# EAGLE schematic HC05-mdl V04 (EAGLE 7.4.0)
3v3 to TTL interfaceboard for HC-04/05/06 bluetoothmodule Dipswitch is provided for manual setting AT-mode to programming module Powersupply led and State led are added for easy monitoring
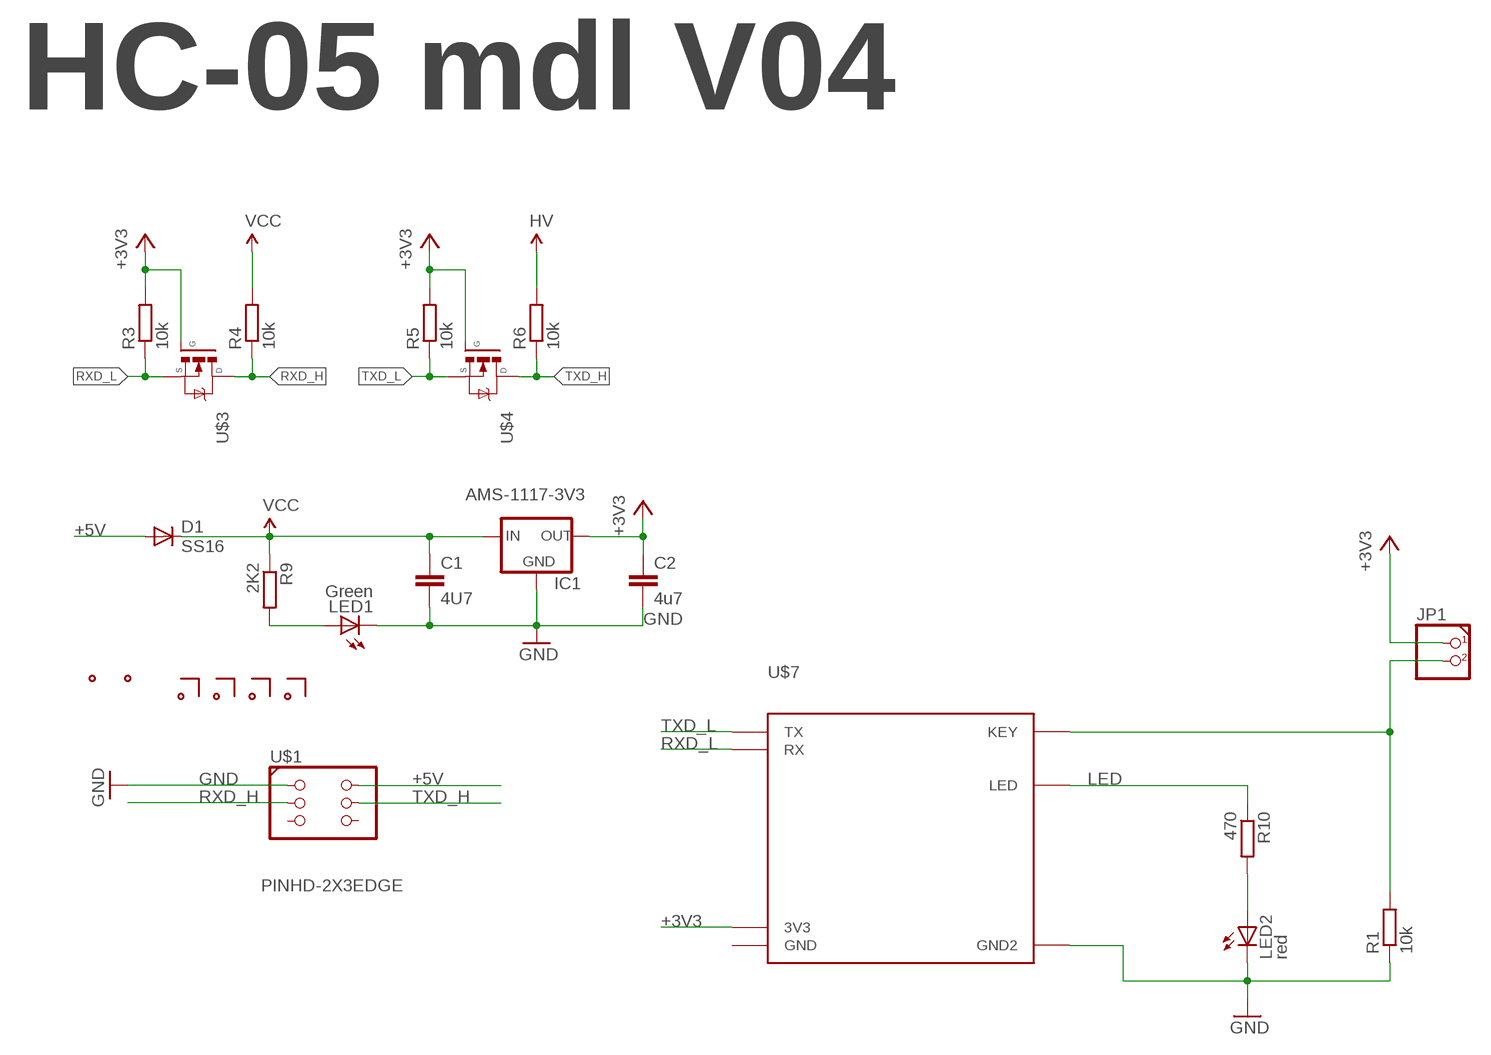
[diagram p0: schematic, sheet 1]

## Parts
C1  4U7  C-EUC0805  [C0805]
C2  4u7  C-EUC0805  [C0805]
D1  SS16  DIODE-DO214AC  [DO214AC]
IC1  AMS-1117-3V3  LM1117  [SOT223]
JP1  PINHD-1X2  [1X02]
LED1  Green  LEDCHIPLED_1206  [CHIPLED_1206]
LED2  red  LEDCHIPLED_1206  [CHIPLED_1206]
R1  10k  R-EU_R0805  [R0805]
R3  10k  R-EU_R0805  [R0805]
R4  10k  R-EU_R0805  [R0805]
R5  10k  R-EU_R0805  [R0805]
R6  10k  R-EU_R0805  [R0805]
R9  2K2  R-EU_R0805  [R0805]
R10  470  R-EU_R0805  [R0805]
U$1  PINHD-2X3EDGE  [2X03EDGE]
U$2  MARKER  [MARKER]
U$3  2N7002-S  [SOT23-FET-SMALL]
U$4  2N7002-S  [SOT23-FET-SMALL]
U$5  MARKER  [MARKER]
U$6  MARKERDUAL-60  [MARKER60]
U$7  HC-05-MIN  [HC-05-MIN-SMD]
U$8  MARKER  [MARKER]
U$9  MARKER  [MARKER]

## Nets
+3V3: C2.1 IC1.2(OUT) IC1.4(OUT) JP1.1 R3.2 R5.2 U$3.G U$4.G U$7.3V3
+5V: D1.A U$1.P$2
GND: C1.2 C2.2 IC1.1(GND) LED1.C LED2.C R1.1 U$1.P$1 U$7.GND2
KEY_L: JP1.2 R1.2 U$7.KEY
LED: R10.1 U$7.LED
N$1: LED1.A R9.2
N$2: LED2.A R10.2
RXD_H: R4.1 U$1.P$3 U$3.D
RXD_L: R3.1 U$3.S U$7.RX
TXD_H: R6.1 U$1.P$4 U$4.D
TXD_L: R5.1 U$4.S U$7.TX
VCC: C1.1 D1.C IC1.3(IN) R4.2 R6.2 R9.1 ; supply symbol labelled HV
Unconnected: U$1.P$5 U$1.P$6 U$7.GND

## Notes on the sheet
- HC-05 mdl V04

## Library data of the parts
C1 C2 = rcl:C-EU: CAPACITOR, European symbol
D1 = MyLib:DIODE: DIODE Diode
IC1 = v-reg-3:LM1117
JP1 = MyLib:PINHD-1X2: PIN HEADER
LED1 LED2 = led:LED: LED OSRAM: - CHIPLED LG R971, LG N971, LY N971, LG Q971, LY Q971, LO R971, LY R971 LH N974, LH R974 LS Q976, LO Q976, LY Q976 LO Q996 - Hyper CHIPLED LW Q18S LB Q993, LB Q99A, LB R99A - SideLED LS A670, LO A670, LY A670, LG A670, LP A670 LB A673, LV A673, LT A673, LW A673 LH A674 LY A675 LS A676, LA A676, LO A676, LY A676, LW A676 LS A679, LY A679, LG A679 - Hyper Micro SIDELED® LS Y876, LA Y876, LO Y876, LY Y876 LT Y87S - SmartLED LW L88C, LW L88S LB L89C, LB L89S, LG L890 LS L89K, LO L89K, LY L89K LS L896, LA L896, LO L896, LY L896 - TOPLED LS T670, LO T670, LY T670, LG T670, LP T670 LSG T670, LSP T670, LSY T670, LOP T670, LYG T670 LG T671, LOG T671, LSG T671 LB T673, LV T673, LT T673, LW T673 LH T674 LS T676, LA T676, LO T676, LY T676, LB T676, LH T676, LSB T676, LW T676 LB T67C, LV T67C, LT T67C, LS T67K, LO T67K, LY T67K, LW E67C LS E67B, LA E67B, LO E67B, LY E67B, LB E67C, LV E67C, LT E67C LW T67C LS T679, LY T679, LG T679 LS T770, LO T770, LY T770, LG T770, LP T770 LB T773, LV T773, LT T773, LW T773 LH T774 LS E675, LA E675, LY E675, LS T675 LS T776, LA T776, LO T776, LY T776, LB T776 LHGB T686 LT T68C, LB T68C - Hyper Mini TOPLED® LB M676 - Mini TOPLED Santana® LG M470 LS M47K, LO M47K, LY M47K Source: http://www.osram.convergy.de LUXEON: - LUMILED® LXK2-PW12-R00, LXK2-PW12-S00, LXK2-PW14-U00, LXK2-PW14-V00 LXK2-PM12-R00, LXK2-PM12-S00, LXK2-PM14-U00 LXK2-PE12-Q00, LXK2-PE12-R00, LXK2-PE12-S00, LXK2-PE14-T00, LXK2-PE14-U00 LXK2-PB12-K00, LXK2-PB12-L00, LXK2-PB12-M00, LXK2-PB14-N00, LXK2-PB14-P00, LXK2-PB14-Q00 LXK2-PR12-L00, LXK2-PR12-M00, LXK2-PR14-Q00, LXK2-PR14-R00 LXK2-PD12-Q00, LXK2-PD12-R00, LXK2-PD12-S00 LXK2-PH12-R00, LXK2-PH12-S00 LXK2-PL12-P00, LXK2-PL12-Q00, LXK2-PL12-R00 Source: www.luxeon.com KINGBRIGHT: KA-3528ASYC Source: www.kingbright.com
R1 R3-R6 R9 R10 = rcl:R-EU_: RESISTOR, European symbol
U$1 = MyLib:PINHD-2X3
U$2 U$5 U$8 U$9 = MyLib:MARKER: Marker pad without connections
U$3 U$4 = MyLib:2N7002: 2N7002 N-FET HEX SOT-23
U$6 = MyLib:MARKERDUAL: Marker for Duallayer boards
U$7 = HC-05:HC-05-MIN